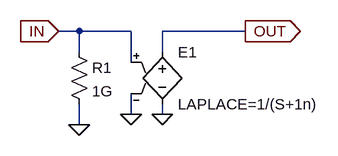
[diagram p0: schematic Integral.asc]
Integral.asc, the LTspice schematic file:
Version 4
SHEET 1 880 680
WIRE 48 -48 16 -48
WIRE 128 -48 48 -48
WIRE 304 -48 176 -48
WIRE 48 -16 48 -48
WIRE 176 -16 176 -48
WIRE 128 0 128 -48
WIRE 128 80 128 48
WIRE 176 80 176 64
WIRE 48 96 48 64
FLAG 304 -48 OUT
IOPIN 304 -48 Out
FLAG 16 -48 IN
IOPIN 16 -48 In
FLAG 48 96 0
FLAG 176 80 0
FLAG 128 80 0
SYMBOL res 32 -32 R0
SYMATTR InstName R1
SYMATTR Value 1G
SYMBOL e 176 -32 R0
SYMATTR InstName E1
SYMATTR Value LAPLACE=1/(S+1n)

The netlist it stands for:
* Integral.asc
R1 IN 0 1G
E1 OUT 0 IN 0 LAPLACE=1/(S+1n)
.backanno
.end